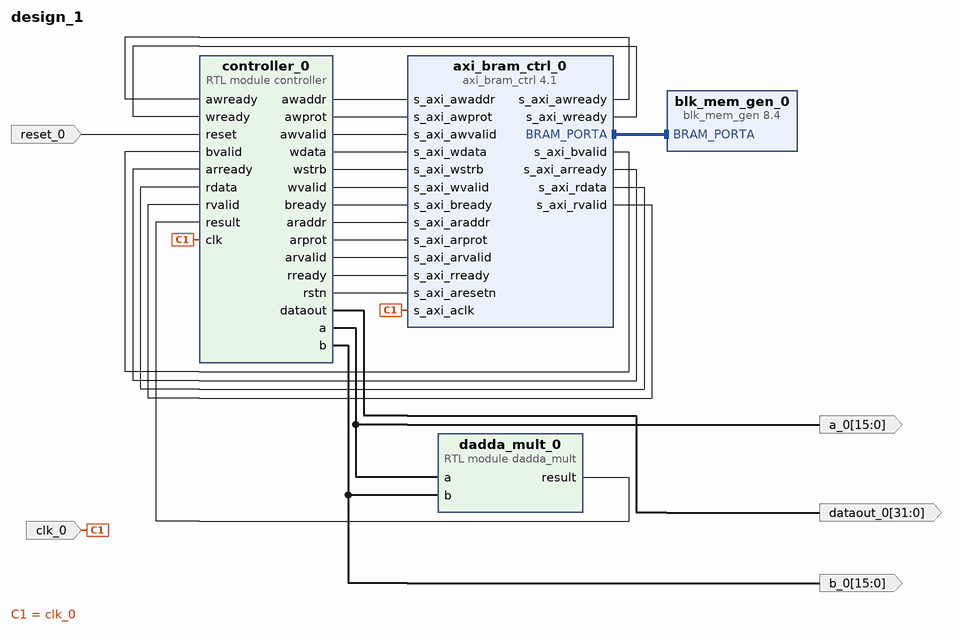
[diagram p0: block diagram of the top level]
# Vivado block design design_1, xc7z020clg400-1, Vivado 2020.2
create_bd_design design_1

create_bd_port -dir I -type clk clk_0
create_bd_port -dir O -from 31 -to 0 dataout_0
create_bd_port -dir I -type rst reset_0
create_bd_port -dir O -from 15 -to 0 a_0
create_bd_port -dir O -from 15 -to 0 b_0

create_bd_cell -type ip -vlnv xilinx.com:ip:axi_bram_ctrl:4.1 axi_bram_ctrl_0
set_property -dict [list \
  CONFIG.PROTOCOL AXI4LITE \
  CONFIG.RD_CMD_OPTIMIZATION 0 \
  CONFIG.SINGLE_PORT_BRAM 1 \
] [get_bd_cells axi_bram_ctrl_0]
create_bd_cell -type ip -vlnv xilinx.com:ip:blk_mem_gen:8.4 blk_mem_gen_0
set_property -dict [list \
  CONFIG.Coe_File c:/Users/sbmur/Downloads/daddaMult1.coe \
  CONFIG.Enable_32bit_Address false \
  CONFIG.Enable_A Use_ENA_Pin \
  CONFIG.Fill_Remaining_Memory_Locations false \
  CONFIG.Load_Init_File true \
  CONFIG.Memory_Type Single_Port_RAM \
  CONFIG.Operating_Mode_A WRITE_FIRST \
  CONFIG.Port_B_Clock 0 \
  CONFIG.Port_B_Enable_Rate 0 \
  CONFIG.Port_B_Write_Rate 0 \
  CONFIG.Read_Width_A 32 \
  CONFIG.Register_PortA_Output_of_Memory_Core false \
  CONFIG.Register_PortA_Output_of_Memory_Primitives false \
  CONFIG.Use_Byte_Write_Enable false \
  CONFIG.Use_RSTA_Pin false \
  CONFIG.Write_Depth_A 32768 \
  CONFIG.Write_Width_A 32 \
  CONFIG.use_bram_block Stand_Alone \
] [get_bd_cells blk_mem_gen_0]
create_bd_cell -type module -reference dadda_mult dadda_mult_0
create_bd_cell -type module -reference controller controller_0

# ---- connections ----

connect_bd_intf_net [get_bd_intf_pins axi_bram_ctrl_0/BRAM_PORTA] [get_bd_intf_pins blk_mem_gen_0/BRAM_PORTA]
connect_bd_net [get_bd_pins controller_0/awaddr] [get_bd_pins axi_bram_ctrl_0/s_axi_awaddr]
connect_bd_net [get_bd_pins controller_0/awprot] [get_bd_pins axi_bram_ctrl_0/s_axi_awprot]
connect_bd_net [get_bd_pins controller_0/awvalid] [get_bd_pins axi_bram_ctrl_0/s_axi_awvalid]
connect_bd_net [get_bd_pins axi_bram_ctrl_0/s_axi_awready] [get_bd_pins controller_0/awready]
connect_bd_net [get_bd_pins controller_0/wdata] [get_bd_pins axi_bram_ctrl_0/s_axi_wdata]
connect_bd_net [get_bd_pins controller_0/wstrb] [get_bd_pins axi_bram_ctrl_0/s_axi_wstrb]
connect_bd_net [get_bd_pins controller_0/wvalid] [get_bd_pins axi_bram_ctrl_0/s_axi_wvalid]
connect_bd_net [get_bd_pins axi_bram_ctrl_0/s_axi_wready] [get_bd_pins controller_0/wready]
connect_bd_net [get_bd_pins axi_bram_ctrl_0/s_axi_bvalid] [get_bd_pins controller_0/bvalid]
connect_bd_net [get_bd_pins controller_0/bready] [get_bd_pins axi_bram_ctrl_0/s_axi_bready]
connect_bd_net [get_bd_pins controller_0/araddr] [get_bd_pins axi_bram_ctrl_0/s_axi_araddr]
connect_bd_net [get_bd_pins controller_0/arprot] [get_bd_pins axi_bram_ctrl_0/s_axi_arprot]
connect_bd_net [get_bd_pins axi_bram_ctrl_0/s_axi_arready] [get_bd_pins controller_0/arready]
connect_bd_net [get_bd_pins controller_0/arvalid] [get_bd_pins axi_bram_ctrl_0/s_axi_arvalid]
connect_bd_net [get_bd_pins axi_bram_ctrl_0/s_axi_rdata] [get_bd_pins controller_0/rdata]
connect_bd_net [get_bd_pins axi_bram_ctrl_0/s_axi_rvalid] [get_bd_pins controller_0/rvalid]
connect_bd_net [get_bd_pins controller_0/rready] [get_bd_pins axi_bram_ctrl_0/s_axi_rready]
connect_bd_net [get_bd_pins controller_0/rstn] [get_bd_pins axi_bram_ctrl_0/s_axi_aresetn]
connect_bd_net -net clk_0_1 [get_bd_ports clk_0] [get_bd_pins axi_bram_ctrl_0/s_axi_aclk] [get_bd_pins controller_0/clk]
connect_bd_net [get_bd_pins controller_0/dataout] [get_bd_ports dataout_0]
connect_bd_net -net reset_0_1 [get_bd_ports reset_0] [get_bd_pins controller_0/reset]
connect_bd_net [get_bd_pins dadda_mult_0/result] [get_bd_pins controller_0/result]
connect_bd_net [get_bd_pins controller_0/a] [get_bd_ports a_0] [get_bd_pins dadda_mult_0/a]
connect_bd_net [get_bd_pins controller_0/b] [get_bd_ports b_0] [get_bd_pins dadda_mult_0/b]

validate_bd_design
save_bd_design
